# EAGLE design L6470 AutoDriver (EAGLE 7.6.0)
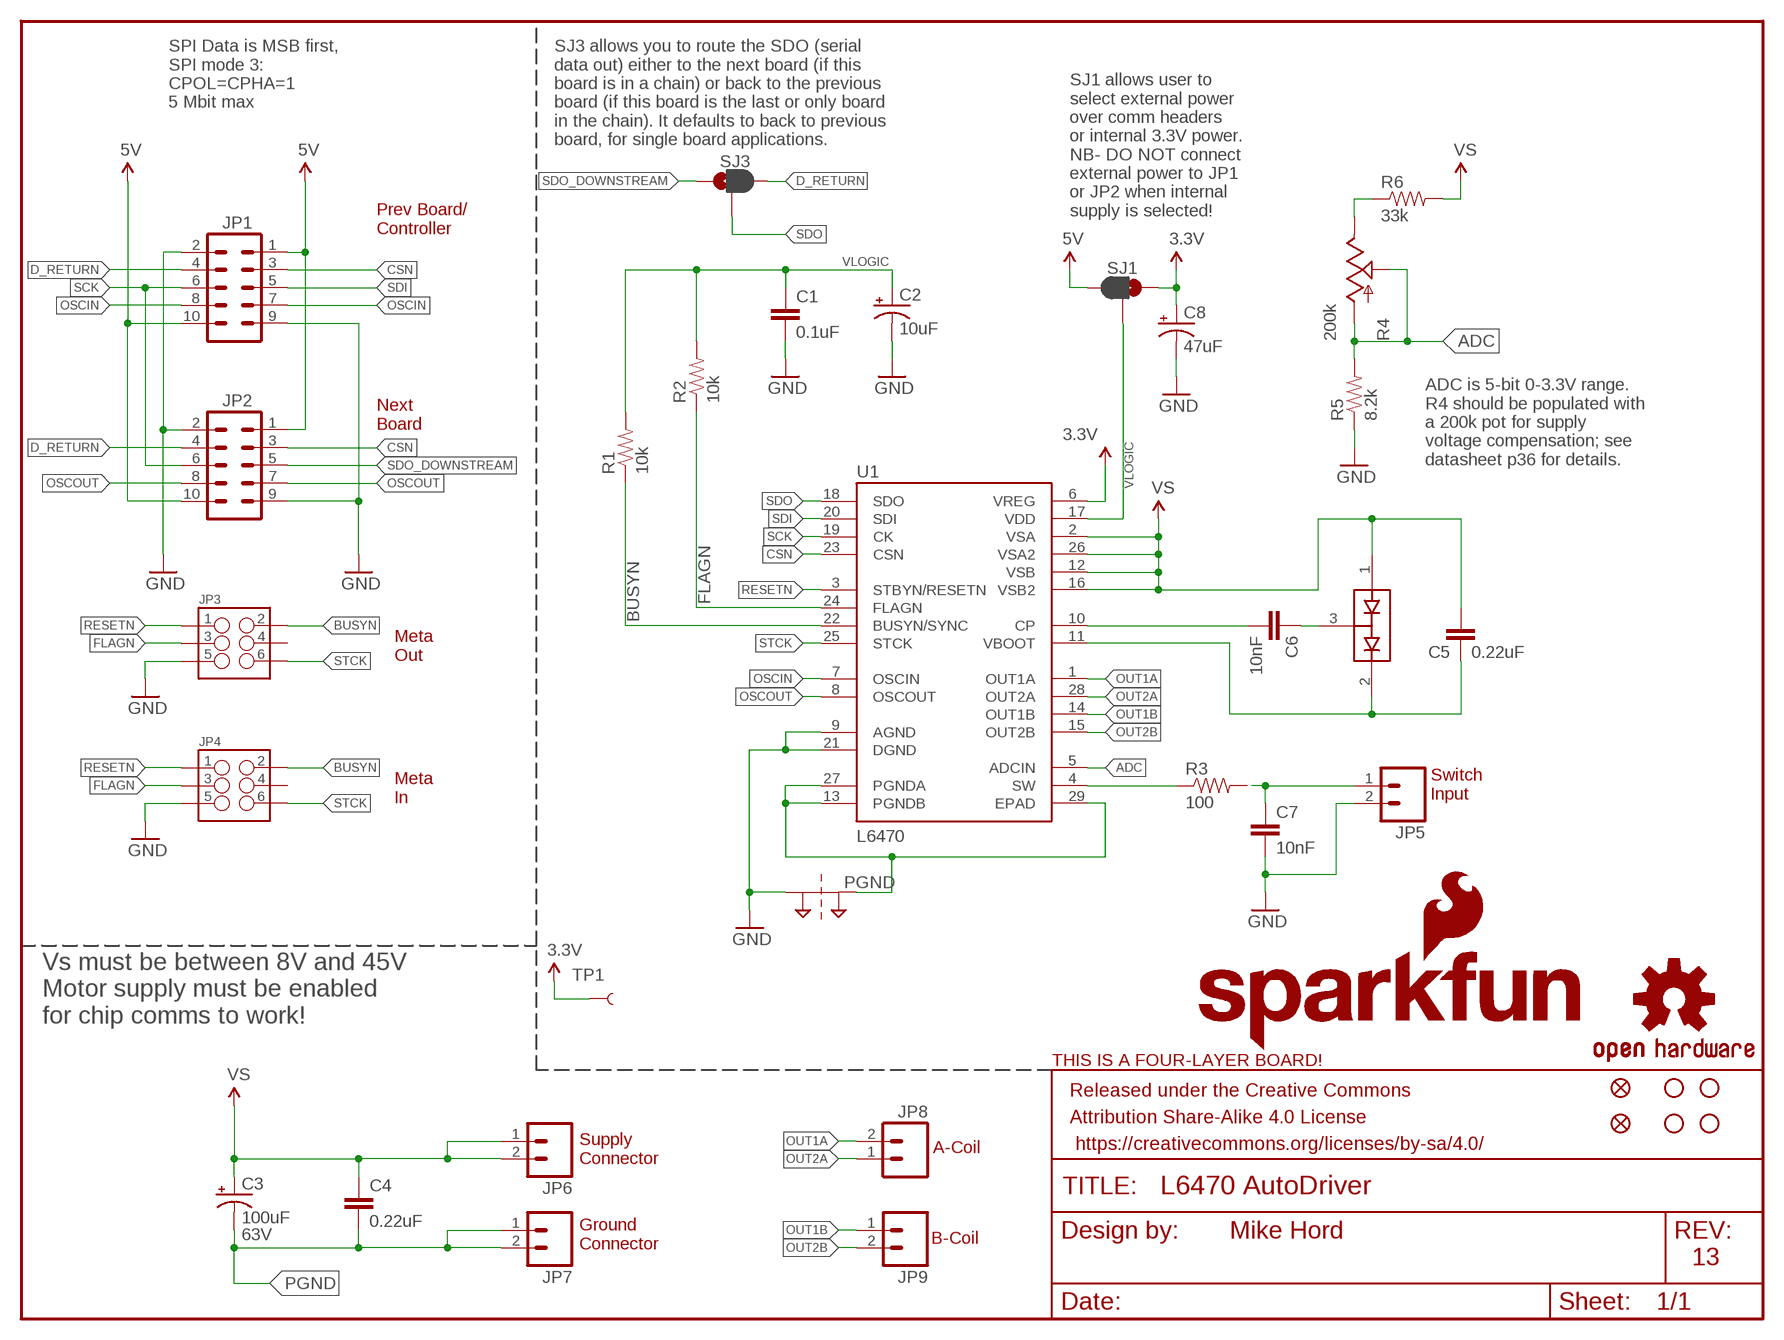
[diagram p0: schematic, sheet 1]

## Parts
C1  0.1uF  0.1UF-25V(+80/-20%)(0603)  [0603-CAP]
C2  10uF  10UF-TANT  [EIA3216]
C3  100uF  100UF-63V-20%(ELECT)  [NIC_10X10.5_CAP]
C4  0.22uF  0.22UF50V-20%,+80%(0603)  [0603-CAP]
C5  0.22uF  0.22UF50V-20%,+80%(0603)  [0603-CAP]
C6  10nF  10NF/10000PF-50V-10%(0603)  [0603-CAP]
C7  10nF  10NF/10000PF-50V-10%(0603)  [0603-CAP]
C8  47uF  47UF-TANT  [EIA3528]
D1  BAV99  [SOT23-3]
FID1  FIDUCIALUFIDUCIAL  [MICRO-FIDUCIAL]
FID2  FIDUCIALUFIDUCIAL  [MICRO-FIDUCIAL]
FRAME1  FRAME-LETTER  [CREATIVE_COMMONS]
JP1  M05X2SHD  [2X5-SHROUDED]
JP2  M05X2SHD  [2X5-SHROUDED]
JP3  M03X2SHROUD  [2X3-SHROUDED]
JP4  M03X2SHROUD  [2X3-SHROUDED]
JP5  M023.5MM  [SCREWTERMINAL-3.5MM-2]
JP6  M023.5MM  [SCREWTERMINAL-3.5MM-2]
JP7  M023.5MM  [SCREWTERMINAL-3.5MM-2]
JP8  M023.5MM  [SCREWTERMINAL-3.5MM-2]
JP9  M023.5MM  [SCREWTERMINAL-3.5MM-2]
LOGO1  OSHW-LOGOM  [OSHW-LOGO-M]
LOGO2  SFE_LOGO_NAME_FLAME.2_INCH  [SFE_LOGO_NAME_FLAME_.2]
R1  10k  10KOHM1/10W1%(0603)0603  [0603-RES]
R2  10k  10KOHM1/10W1%(0603)0603  [0603-RES]
R3  100  100OHM1/10W1%(0603)  [0603-RES]
R4  200k  POT100K_3362U  [3362U]
R5  8.2k  8.2KOHM-1/10W-5%(0603)  [0603-RES]
R6  33k  33KOHM1/10W1%(0603)  [0603-RES]
SJ1  JUMPER-PAD-3-2OF3_NC_BY_PASTE  [PAD-JUMPER-3-2OF3_NC_BY_PASTE_YES_SILK_FULL_BOX]
SJ2  2PT_GND_TIE  [2PT_GND_TIE]
SJ3  JUMPER-PAD-3-2OF3_NC_BY_PASTE  [PAD-JUMPER-3-2OF3_NC_BY_PASTE_YES_SILK_FULL_BOX]
STANDOFF1  STAND-OFF  [STAND-OFF]
STANDOFF2  STAND-OFF  [STAND-OFF]
STANDOFF3  STAND-OFF  [STAND-OFF]
STANDOFF4  STAND-OFF  [STAND-OFF]
TP1  TEST-POINTTP_15TH_THRU  [TP_15TH]
U1  L6470  L6470  [HTSSOP28]
U$4  FOUR_LAYER_WARNING  [FOUR_LAYER_WARNING]

## Nets
3.3V: C8.A(+) SJ1.1 TP1.P$1 U1.6(VREG)
5V: JP1.1 JP1.10 JP2.1 JP2.10 SJ1.3
ADC: R4.P$2(S) R4.P$3(A) R5.2 U1.5(ADCIN)
BUSYN: JP3.2 JP4.2 R1.1 U1.22(BUSYN/SYNC)
CP_HIGH: C6.1 D1.3(COM)
CSN: JP1.3 JP2.3 U1.23(CSN)
D_RETURN: JP1.4 JP2.4 SJ3.3
FLAGN: JP3.3 JP4.3 R2.1 U1.24(FLAGN)
GND: C1.2 C2.C(-) C7.2 C8.C(-) JP1.2 JP1.9 JP2.2 JP2.9 JP3.5 JP4.5 JP5.2 R5.1 SJ2.P$1 U1.9(AGND) U1.21(DGND)
N$11: R4.P$1(E) R6.1
OSCIN: JP1.7 JP1.8 U1.7(OSCIN)
OSCOUT: JP2.7 JP2.8 U1.8(OSCOUT)
OUT1A: JP8.2 U1.1(OUT1A)
OUT1B: JP9.1 U1.14(OUT1B)
OUT2A: JP8.1 U1.28(OUT2A)
OUT2B: JP9.2 U1.15(OUT2B)
PGND: C3.- C4.2 JP7.1 JP7.2 SJ2.P$2 U1.13(PGNDB) U1.27(PGNDA) U1.29(EPAD)
RESETN: JP3.1 JP4.1 U1.3(STBYN/RESETN)
SCK: JP1.6 JP2.6 U1.19(CK)
SDI: JP1.5 U1.20(SDI)
SDO: SJ3.2 U1.18(SDO)
SDO_DOWNSTREAM: JP2.5 SJ3.1
STCK: JP3.6 JP4.6 U1.25(STCK)
SWITCH_INPUT: C7.1 JP5.1 R3.2
SWITCH_SIG: R3.1 U1.4(SW)
V_BOOT: C5.1 D1.2(C2) U1.11(VBOOT)
V_CP: C6.2 U1.10(CP)
VLOGIC: C1.1 C2.A(+) R1.2 R2.2 SJ1.2 U1.17(VDD)
VS: C3.+ C4.1 C5.2 D1.1(A1) JP6.1 JP6.2 R6.2 U1.2(VSA) U1.12(VSB) U1.16(VSB2) U1.26(VSA2)
Unconnected: JP3.4 JP4.4

## Notes on the sheet
- SPI Data is MSB first,
  SPI mode 3:
  CPOL=CPHA=1
  5 Mbit max
- SJ3 allows you to route the SDO (serial 
  data out) either to the next board (if this 
  board is in a chain) or back to the previous 
  board (if this board is the last or only board 
  in the chain). It defaults to back to previous 
  board, for single board applications.
- SJ1 allows user to
  select external power
  over comm headers
  or internal 3.3V power.
  NB- DO NOT connect
  external power to JP1
  or JP2 when internal
  supply is selected!
- Prev Board/
  Controller
- Next
  Board
- ADC is 5-bit 0-3.3V range.
  R4 should be populated with
  a 200k pot for supply
  voltage compensation; see
  datasheet p36 for details.
- Meta
  Out
- Switch
  Input
- Meta
  In
- Vs must be between 8V and 45V
  Motor supply must be enabled
  for chip comms to work!
- A-Coil
- Supply
  Connector
- 63V | B-Coil
- Ground
  Connector
- Mike Hord | 13

## Library data of the parts
C1 = SparkFun-Capacitors:0.1UF-25V(+80/-20%)(0603): CAP-00810 Ceramic Standard decoupling cap; PROD_ID: CAP-00810
C2 = SparkFun-Capacitors:10UF-TANT: 10uF Tantalum SMT CAP-00811- 16V 10% (EIA-3216); PROD_ID: CAP-00811
C3 = SparkFun-Capacitors:100UF-63V-20%(ELECT): CAP-08362 100uF electrolytic SMT 63V 20%; PROD_ID: CAP-08362
C4 C5 = SparkFun-Capacitors:0.22UF50V-20%,+80%(0603): CAP-09885; PROD_ID: CAP-09885
C6 C7 = SparkFun-Capacitors:10NF/10000PF-50V-10%(0603): CAP-00867; PROD_ID: CAP-00867
C8 = SparkFun-Capacitors:47UF-TANT: 47uF Tantalum SMT CAP-08310- 10V 10% (EIA-3528); PROD_ID: CAP-08310
D1 = SparkFun-DiscreteSemi:BAV99: Two small signal silicon diodes connected anode to cathode. Connections to all three nodes available. DIO-10647; PROD_ID: DIO-10647
FID1 FID2 = SparkFun-Aesthetics:FIDUCIAL: Fiducial Alignment Points Various fiducial points for machine vision alignment.
FRAME1 = SparkFun-Aesthetics:FRAME-LETTER: Schematic Frame Standard 8.5x11 US Letter frame
JP1 JP2 = SparkFun-Connectors:M05X2: Header 5x2 Standard 10-pin dual row 0.1" header. Commonly used with AVR-ISP. Use with Spark Fun Electronics SKU: PRT-00778
JP3 JP4 = SparkFun-Connectors:M03X2: 2x3 .1" header. Shrouded, with keying- CONN-10681 SMT- CONN-11415 Pogo pins- HW-11044; PROD_ID: CONN-10681
JP5-JP9 = SparkFun:M02: Header 2 Standard 2-pin 0.1" header. Use with straight break away headers (SKU : PRT-00116), right angle break away headers (PRT-00553), swiss pins (PRT-00743), machine pins (PRT-00117), and female headers (PRT-00115). Molex polarized connector foot print use with SKU : PRT-08233 with associated crimp pins and housings.
LOGO1 = SparkFun-Aesthetics:OSHW-LOGO: Open Source Hardware Logo This logo indicates the piece of hardware it is found on incorporates a OSHW license and/or adheres to the definition of open source hardware found here: http://freedomdefined.org/OSHW
LOGO2 = SparkFun-Aesthetics:SFE_LOGO_NAME_FLAME: SFE Logo, name and flame This is the SparkFun full logo. The logo on the schematic will always be the same size; the package variant is the height of the flame part of the logo. Default layer for the logo on the board is tSilk.
R1 R2 = SparkFun-Resistors:10KOHM1/10W1%(0603): RES-00824; PROD_ID: RES-00824; VALUE: 10K
R3 = SparkFun-Resistors:100OHM1/10W1%(0603): RES-07863; PROD_ID: RES-07863
R4 = SparkFun-Electromechanical:POT
R5 = SparkFun-Resistors:8.2KOHM-1/10W-5%(0603): RES-10646; PROD_ID: RES-10646
R6 = SparkFun-Resistors:33KOHM1/10W1%(0603): RES-08416; PROD_ID: RES-08416
SJ1 SJ3 = SparkFun-Passives:JUMPER-PAD-3-2OF3_NC_BY_PASTE
SJ2 = SparkFun-Passives:2PT_GND_TIE: Package for connecting two ground nets in one place.
STANDOFF1-STANDOFF4 = SparkFun:STAND-OFF: Stand Off This is the mechanical footprint for a #4 phillips button head screw. Use the keepout ring to avoid running the screw head into surrounding components. SKU : PRT-00447
TP1 = SparkFun-Passives:TEST-POINT: Bare copper test points for troubleshooting or ICT
U1 = SparkFun-PowerIC:L6470: 3A RMS/7A peak bipolar stepper motor driver with SPI control and step input in HTSSOP-28 package. IC-10648; PROD_ID: IC-10648
U$4 = SparkFun-Aesthetics:FOUR_LAYER_WARNING: Warning text which will appear on both the schematic and the board file, notifying viewers that the design is a four-layer PCB.

## Board
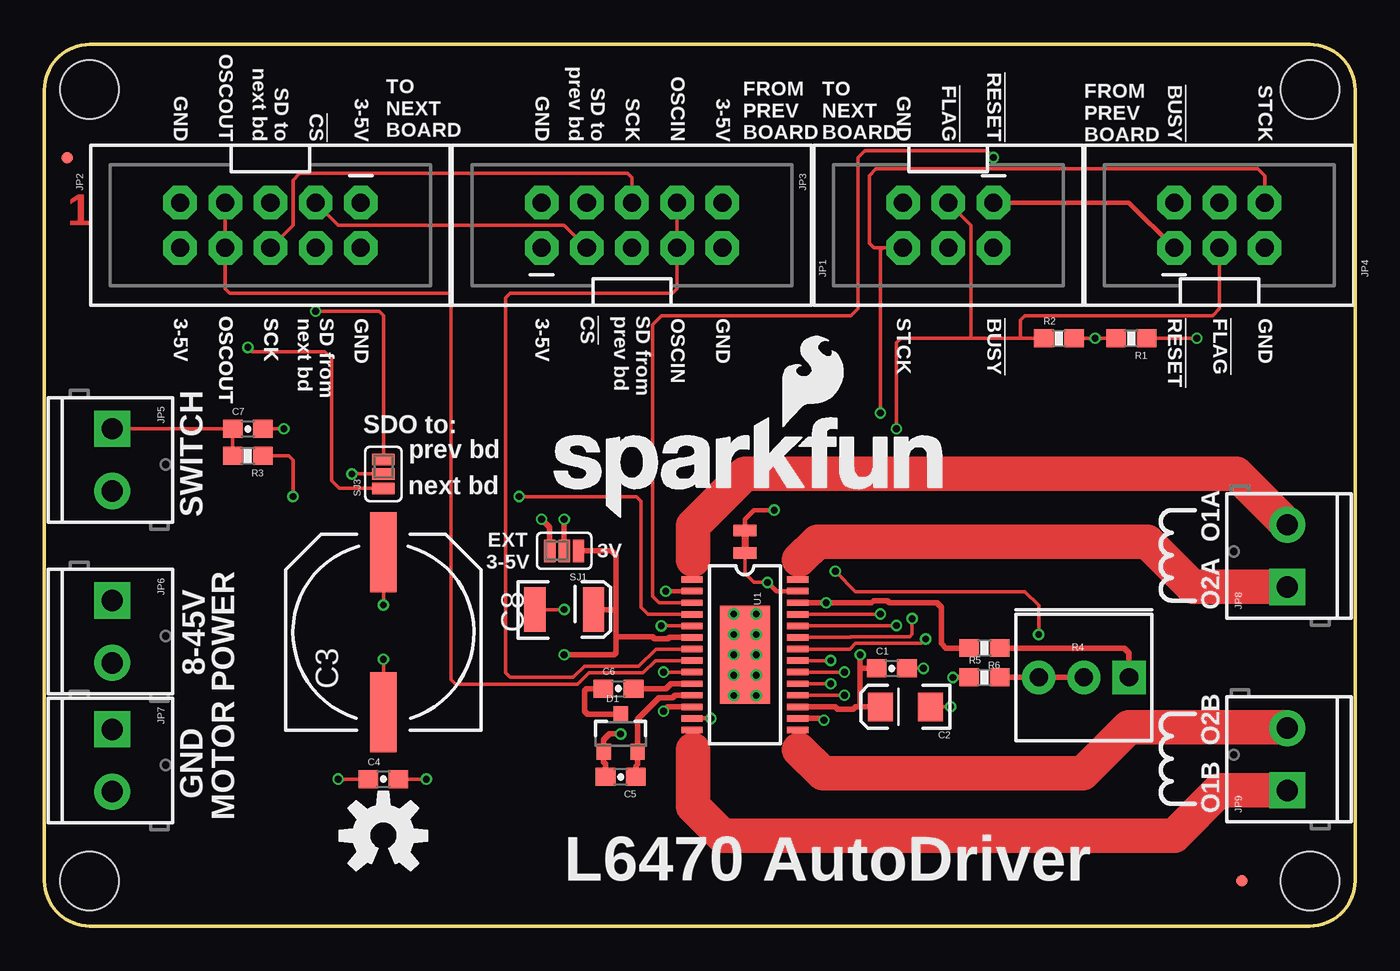
[diagram p1: board, top side]
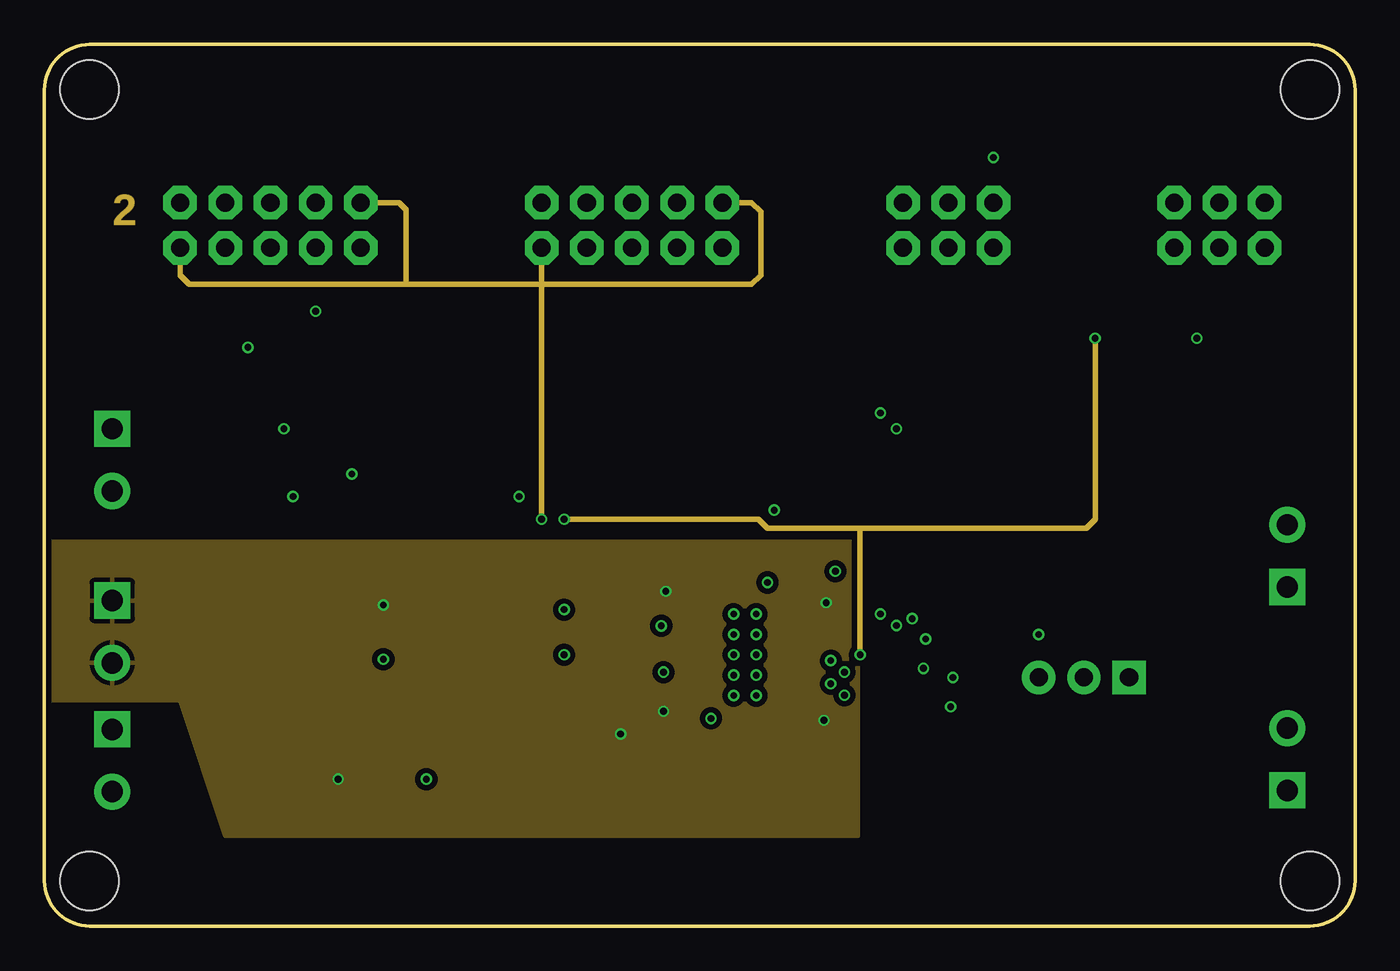
[diagram p2: board, inner layer Route2]
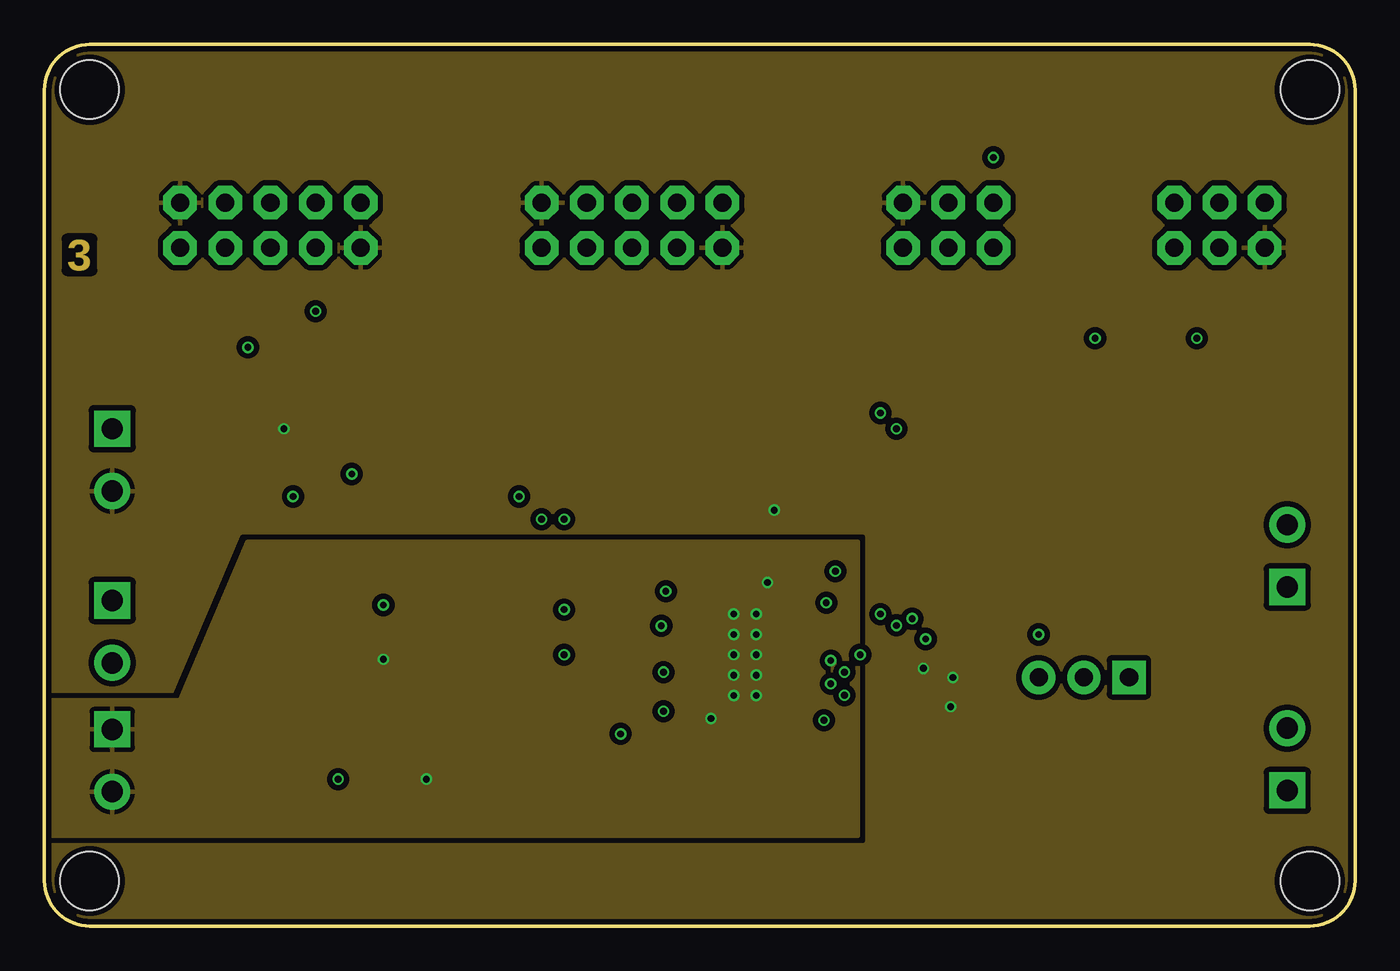
[diagram p3: board, inner layer Route15]
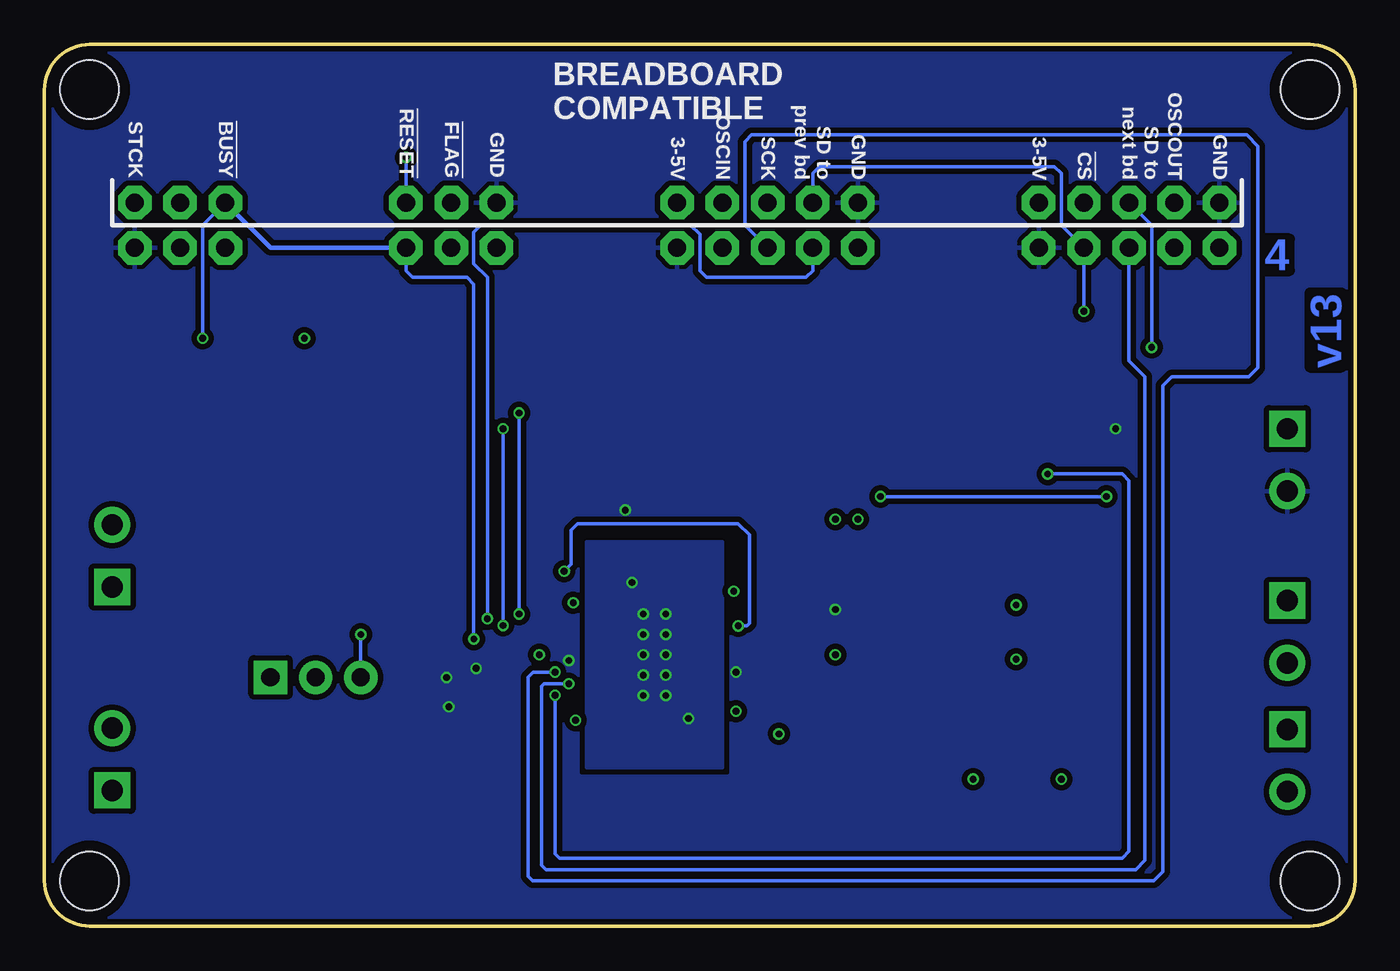
[diagram p4: board, bottom side, seen from below]

Size 73.66 x 49.53 mm. Coordinates in mm from the lower left corner, seen from the top.
Outline: 71.12,0 2.54,0 arc-90 0,2.54 0,46.99 arc-90 2.54,49.53 71.12,49.53 arc-90 73.66,46.99 73.66,2.54 arc-90 71.12,0
Copper layers (1*2*15*16): Top 0.035mm / dielectric 0.2mm / Route2 0.035mm / dielectric 0.15mm / Route15 0.035mm / dielectric 0.2mm / Bottom 0.035mm
Design rules "Gold_Phoenix_Standard_Spec_4_layer *": minimum track width 5mil, minimum drill 6mil, track to track 5mil, track to pad 5mil, pad to pad 5mil, via to via 5mil, smd to smd 0mil, copper to edge 8mil, drill to drill 8mil, minimum pad ring 5mil, minimum via ring 5mil, stop-mask expansion 4mil, vias tented up to drill 20mil, thermal gap 10mil

### Footprints (pad centres in the part's own frame; a part is rotated, then mirrored left to right if it is on the bottom)
0603-CAP = smd 1.1 x 1: 1 -0.85,0; 2 0.85,0
EIA3216 = smd 1.4 x 1.6: A 1.4,0; C -1.4,0
NIC_10X10.5_CAP = smd 4.5 x 1.5: + 4.5,0; - -4.5,0
EIA3528 = smd 1.2 x 2.5: A 1.65,0; C -1.65,0
SOT23-3 = smd 0.8 x 0.9: 1 -0.95,-1; 2 0.95,-1; 3 0,1.1
MICRO-FIDUCIAL = smd 0.635 x 0.635: 1 0,0
2X5-SHROUDED = drill 1.016 pad 1.88 octagon: 1 -1.27,5.08; 2 1.27,5.08; 3 -1.27,2.54; 4 1.27,2.54; 5 -1.27,0; 6 1.27,0; 7 -1.27,-2.54; 8 1.27,-2.54; 9 -1.27,-5.08; 10 1.27,-5.08
2X3-SHROUDED = drill 1.016 pad 1.88 octagon: 1 -1.27,2.54; 2 1.27,2.54; 3 -1.27,0; 4 1.27,0; 5 -1.27,-2.54; 6 1.27,-2.54
SCREWTERMINAL-3.5MM-2 = drill 1.2 pad 2.032 square: 1 0,0 | drill 1.2 pad 2.032: 2 3.5,0
0603-RES = smd 1.1 x 1: 1 -0.85,0; 2 0.85,0
3362U = drill 1.016 pad 1.88 square: P$1 0,2.54 | drill 1.016 pad 1.88: P$2 2.54,2.54; P$3 5.08,2.54
PAD-JUMPER-3-2OF3_NC_BY_PASTE_YES_SILK_FULL_BOX = smd 0.635 x 1.27: 1 -0.813,0; 2 0,0; 3 0.813,0
2PT_GND_TIE = smd 1.27 x 0.635: P$1 0,0.635; P$2 0,-0.635
STAND-OFF = hole 3.302: 0,0
TP_15TH = drill 0.381 pad 0.61: P$1 0,0
HTSSOP28 = smd 0.36 x 1.19: 1 -4.225,-2.97; 2 -3.575,-2.97; 3 -2.925,-2.97; 4 -2.275,-2.97; 5 -1.625,-2.97; 6 -0.975,-2.97; 7 -0.325,-2.97; 8 0.325,-2.97; 9 0.975,-2.97; 10 1.625,-2.97; 11 2.275,-2.97; 12 2.925,-2.97; 13 3.575,-2.97; 14 4.225,-2.97; 15 4.225,2.97; 16 3.575,2.97; 17 2.925,2.97; 18 2.275,2.97; 19 1.625,2.97; 20 0.975,2.97; 21 0.325,2.97; 22 -0.325,2.97; 23 -0.975,2.97; 24 -1.625,2.97; 25 -2.275,2.97; 26 -2.925,2.97; 27 -3.575,2.97; 28 -4.225,2.97 | smd 5.5 x 2.8: 29 0,0

### Placement (x,y rotation side)
C1  47.62,14.48 0 top
C2  48.39,12.32 180 top
C3  19.05,16.51 90 top
C4  19.05,8.26 0 top
C5  32.38,8.38 180 top
C6  32.26,13.34 0 top
C7  11.43,27.94 0 top
C8  29.21,17.78 0 top
D1  32.38,10.79 0 top
FID1  67.31,2.54 0 top
FID2  1.27,43.18 0 top
FRAME1  21.59,-25.4 0 top  (outside the outline)
JP1  33.02,39.37 90 top
JP2  12.7,39.37 270 top
JP3  50.8,39.37 270 top
JP4  66.04,39.37 90 top
JP5  3.81,27.94 270 top
JP6  3.81,18.29 270 top
JP7  3.81,11.05 270 top
JP8  69.85,19.05 90 top
JP9  69.85,7.62 90 top
LOGO1  19.05,5.08 0 top
LOGO2  27.94,22.86 0 top
R1  61.09,33.02 180 top
R2  57.02,33.02 0 top
R3  11.43,26.42 180 top
R4  60.96,16.51 180 top
R5  52.83,13.97 0 top
R6  52.83,15.62 180 top
SJ1  29.21,21.08 180 top
SJ2  39.37,21.59 0 top
SJ3  19.05,25.4 90 top
STANDOFF1  71.12,46.99 0 top
STANDOFF2  71.12,2.54 0 top
STANDOFF3  2.54,2.54 0 top
STANDOFF4  2.54,46.99 0 top
TP1  29.21,15.24 0 top
U1  39.37,15.24 270 top
U$4  58.42,-7.62 0 top  (outside the outline)

### Tracks (layer width: path | path; a pad name or v marks a point on that pad's centre or on a via)
3.3V
  Top 0.203: 32.17,16.21 32.13,16.26
  Top 0.305: U1.6 35.14,16.21 35.05,16.13 34.29,16.13 34.16,16.26 32.13,16.26 | 32.13,16.26 32.13,15.37 32,15.24 TP1.P$1 | 30.73,21.08 SJ1.1 31.88,21.08 32.13,20.83 32.13,17.78 | C8.A 32.13,17.78 | 32.13,16.26 32.13,17.78
5V  (via drill 0.38)
  Top 0.305: SJ1.3 28.4,22.4 v27.94,22.86
  Route2 0.305: v27.94,22.86 27.94,35.94 | 27.94,35.94 27.94,36.07 | 27.94,36.07 JP1.1 | JP2.10 7.62,36.58 8.13,36.07 20.32,36.07 | 20.32,36.07 27.94,36.07 | JP2.1 19.94,40.64 20.32,40.26 20.32,36.07 | JP1.10 39.75,40.64 40.26,40.13 40.26,36.58 39.75,36.07 28.07,36.07 27.94,35.94
ADC  (via drill 0.38)
  Top 0.203: U1.5 v34.67,16.86 | v44.45,19.94 45.59,18.8 55.12,18.8 55.88,18.03 v55.88,16.38
  Top 0.305: R4.P$2 R4.P$3 R5.2
  Bottom 0.203: v34.67,16.86 34.19,16.86 34.04,17.02 34.04,21.97 34.67,22.61 43.69,22.61 44.07,22.23 44.07,20.32 v44.45,19.94 | v55.88,16.38 R4.P$3
BUSYN  (via drill 0.38)
  Top 0.203: R1.1 v64.77,33.02 | U1.22 45.28,15.56 45.59,15.88 49.28,15.88 v49.53,16.13
  Bottom 0.203: v64.77,33.02 64.77,39.37 JP4.2 | v49.53,16.13 49.53,36.07 49.91,36.45 52.96,36.45 53.34,36.83 JP3.2
  Bottom 0.254: JP3.2 60.96,38.1 JP4.2
CP_HIGH
  Top 0.305: D1.3 30.52,11.89 30.35,12.06 30.35,13.21 30.48,13.34 C6.1
CSN  (via drill 0.38)
  Top 0.203: JP2.3 16.51,39.37 29.21,39.37 JP1.3 | U1.23 45.3,16.21 45.34,16.26 48.64,16.26 48.77,16.38 v48.77,17.27
  Bottom 0.203: v48.77,17.27 48.77,36.45 49.53,37.21 49.53,38.99 49.15,39.37 37.34,39.37 36.83,38.86 36.83,36.83 36.45,36.45 30.86,36.45 30.48,36.83 JP1.3
D_RETURN  (via drill 0.38)
  Top 0.203: SJ3.3 19.05,34.29 18.8,34.54 v15.24,34.54
  Bottom 0.203: v15.24,34.54 JP2.4 16.51,39.37 16.51,42.29 16.89,42.67 30.1,42.67 30.48,42.29 JP1.4
FLAGN  (via drill 0.38)
  Top 0.203: JP3.3 52.07,39.37 52.07,33.02 | 54.86,33.02 R2.1 | JP4.3 66.04,34.67 65.66,34.29 55.12,34.29 54.86,34.04 54.86,33.02 | U1.24 47.85,16.86 v47.88,16.89 | v47.88,27.94 47.88,32.77 48.13,33.02 52.07,33.02 | 52.07,33.02 54.86,33.02
  Top 0.254: R2.1 55.63,33.02
  Bottom 0.203: v47.88,16.89 v47.88,27.94
GND  (via drill 0.38)
  Top 0.203: U1.9 v34.8,14.27 | C8.C v29.21,17.78 | U1.21 v44.2,14.91 | C2.C v50.93,12.32 | C1.2 v49.4,14.48 | C7.2 v13.46,27.94
  Top 0.254: v41.02,23.37 39.88,23.37 39.37,22.86 SJ2.P$1
  Top 0.305: R5.1 v51.05,13.97
  pour Route15 (isolate 0.305, rank 2): 71.12,0 2.54,0 arc-90 0,2.54 0,46.99 arc-90 2.54,49.53 71.12,49.53 arc-90 73.66,46.99 73.66,2.54 arc-90
  pour Bottom (isolate 0.305, rank 2): 71.12,0 2.54,0 arc-90 0,2.54 0,46.99 arc-90 2.54,49.53 71.12,49.53 arc-90 73.66,46.99 73.66,2.54 arc-90
N$11
  Top 0.305: R6.1 60.71,15.62 60.96,15.37 R4.P$1
OSCIN
  Top 0.203: U1.7 34.36,15.56 33.4,14.61 30.35,14.61 29.72,13.97 26.16,13.97 25.91,14.22 25.91,35.31 26.16,35.56 35.31,35.56 35.56,35.81 JP1.7 JP1.8
OSCOUT
  Top 0.203: JP2.7 JP2.8 10.16,35.81 10.41,35.56 22.73,35.56 22.86,35.43 22.86,13.84 23.11,13.59 29.97,13.59 30.61,14.22 33.66,14.22 34.35,14.91 U1.8
OUT1A
  Top 0.254: U1.1 36.4,20.52 36.45,20.57
  Top 1.93: 36.45,20.57 36.45,22.48 39.37,25.4 67,25.4 JP8.2
OUT1B
  Top 0.254: U1.14 36.4,9.96 36.45,9.91
  Top 1.93: JP9.1 66.04,7.62 63.5,5.08 38.1,5.08 36.45,6.73 36.45,9.91
OUT2A
  Top 0.203: 42.34,20.88 42.34,20.65 42.42,20.57
  Top 0.254: U1.28 42.34,20.88
  Top 1.93: JP8.1 64.52,19.05 61.98,21.59 43.43,21.59 42.42,20.57
OUT2B
  Top 0.254: U1.15 42.34,9.83 | 42.34,9.6 42.34,9.83 | 42.34,9.83 42.42,9.91
  Top 1.93: 42.42,9.91 43.74,8.58 58.36,8.58 60.96,11.18 69.79,11.18 JP9.2
PGND  (via drill 0.38)
  Top 0.203: v40.64,19.3 39.88,19.3 39.37,19.81 SJ2.P$2 | U1.29 v40.01,15.24 | C4.2 v21.46,8.26 | C3.- v19.05,14.99
  Top 0.254: U1.27 41.13,18.82 v40.64,19.3 | U1.13 v37.47,11.66
  other vias: 40.01,12.95 38.73,12.95 40.01,14.1 38.73,14.1 38.73,15.24 40.01,16.38 38.73,16.38 40.01,17.53 38.73,17.53
  pour Route15 (isolate 0.305): 0,5.08 45.72,5.08 45.72,21.59 11.43,21.59 7.62,12.7 0,12.7
  pour Bottom (isolate 0.305): 35.56,8.89 35.56,21.59 43.18,21.59 43.18,8.89
RESETN  (via drill 0.38)
  Top 0.203: U1.3 34.54,18.16 34.16,18.54 34.16,33.78 34.67,34.29 45.34,34.29 45.72,34.67 45.72,43.18 46.1,43.56 52.96,43.56 v53.34,43.18
  Top 0.254: JP3.1 60.96,40.64 JP4.1
  Bottom 0.203: v53.34,43.18 JP3.1
SCK  (via drill 0.38)
  Top 0.203: U1.19 v44.2,13.62 | JP1.6 33.02,42.04 32.77,42.29 14.35,42.29 13.97,41.91 13.97,39.37 JP2.6
  Bottom 0.203: v44.2,13.62 45.57,13.62 45.72,13.46 45.72,3.43 45.47,3.17 12.32,3.17 11.81,3.68 11.81,30.86 12.7,31.75 JP2.6
SDI  (via drill 0.38)
  Top 0.203: U1.20 v44.96,14.27
  Bottom 0.203: v44.96,14.27 46.19,14.27 46.48,13.97 46.48,2.79 46.23,2.54 11.3,2.54 10.79,3.05 10.79,30.35 10.29,30.86 5.97,30.86 5.46,31.37 5.46,43.81 6.1,44.45 33.91,44.45 34.29,44.07 34.29,39.37 JP1.5
SDO  (via drill 0.38)
  Top 0.203: U1.18 v44.96,12.96 | v17.27,25.4 SJ3.2
  Bottom 0.203: v44.96,12.96 44.96,4.06 44.7,3.81 13.08,3.81 12.7,4.19 12.7,25.02 13.08,25.4 v17.27,25.4
SDO_DOWNSTREAM  (via drill 0.38)
  Top 0.203: SJ3.1 16.56,24.59 16.13,25.02 16.13,31.88 15.75,32.26 11.68,32.26 v11.43,32.51
  Bottom 0.203: v11.43,32.51 11.43,39.37 JP2.5
STCK  (via drill 0.38)
  Top 0.203: JP4.6 68.58,42.16 68.2,42.55 46.74,42.55 46.35,42.16 46.35,38.35 46.61,38.1 47.12,38.1 | 47.12,38.1 JP3.6 | U1.25 46.98,17.52 v46.99,17.53 | v46.99,28.83 46.99,37.97 47.12,38.1
  Bottom 0.203: v46.99,17.53 v46.99,28.83
SWITCH_INPUT
  Top 0.203: R3.2 C7.1 JP5.1
SWITCH_SIG  (via drill 0.38)
  Top 0.203: U1.4 33.92,17.52 33.53,17.91 33.53,23.88 33.27,24.13 v26.67,24.13 | v13.97,24.13 13.97,26.16 13.72,26.42 R3.1
  Bottom 0.203: v26.67,24.13 v13.97,24.13
V_BOOT
  Top 0.305: U1.11 35.44,12.96 35.31,12.83 34.54,12.83 33.34,11.62 D1.2 33.34,9.08 33.23,8.98 C5.1
V_CP
  Top 0.305: U1.10 35.2,13.62 34.92,13.34 C6.2
VLOGIC  (via drill 0.38)
  Top 0.203: R2.2 v59.05,33.02 R1.2 | 45.85,12.31 45.97,12.31 45.85,12.44 45.85,13.72
  Top 0.305: SJ1.2 v29.21,22.86 | v45.85,15.24 45.85,14.48 | 45.85,14.48 45.85,12.31 | 45.97,12.31 45.59,12.31 45.47,12.19 44.58,12.19 44.45,12.32 44.45,12.31 U1.17 | 45.97,12.31 C2.A 45.98,12.32 45.97,12.31 | C1.1 45.85,14.48
  Route2 0.305: v29.21,22.86 40.13,22.86 40.64,22.35 45.85,22.35 | 45.85,22.35 58.55,22.35 59.05,22.86 v59.05,33.02 | v45.85,15.24 45.85,22.35
VS  (via drill 0.38)
  Top 0.203: C3.+ v19.05,18.03 | C4.1 v16.51,8.26
  Top 0.254: U1.2 v34.92,18.82
  Top 0.305: U1.16 43.71,11.66 v43.81,11.56 | U1.12 35.05,12.31 v34.8,12.06 | v32.38,10.79 31.75,10.79 31.43,10.48 D1.1 31.43,9.21 31.54,9.11 C5.2 | U1.26 v43.94,18.16 46.48,18.16 46.61,18.29 47.37,18.29 47.5,18.16 50.16,18.16 50.42,17.91 50.42,15.88 50.67,15.62 R6.2
  pour Route2 (isolate 0.305, rank 3): 0,21.59 45.72,21.59 45.72,5.08 10.16,5.08 7.62,12.7 0,12.7

### Text on the board
Top: 1
Route2: 2
Route15: 3
Bottom: 4 | v13
tPlace: GND | OSCOUT | SD to / next bd | !CS | 3-5V | TO / NEXT / BOARD | GND | SD to / prev bd | SCK | OSCIN | 3-5V | FROM / PREV / BOARD | TO / NEXT / BOARD | GND | !FLAG | !RESET | FROM / PREV / BOARD | !BUSY | STCK | 3-5V | OSCOUT | OSCOUT | SCK | SCK | SD from / next bd | GND | 3-5V | !CS | SD from / prev bd | OSCIN | GND | STCK | !BUSY | !RESET | !FLAG | GND | SDO to: | prev bd | next bd | SWITCH | O1A | EXT / 3-5V | 3V | O2A | 8-45V | MOTOR POWER | O2B | GND | O1B | L6470 AutoDriver
bPlace: BREADBOARD / COMPATIBLE | GND | OSCOUT | SD to / next bd | !CS | 3-5V | GND | SD to / prev bd | SCK | OSCIN | 3-5V | GND | !FLAG | !RESET | !BUSY | STCK
Measures: M3/4-40 | (typical) | dimensions / given / in inches
tDocu: Mike Hord